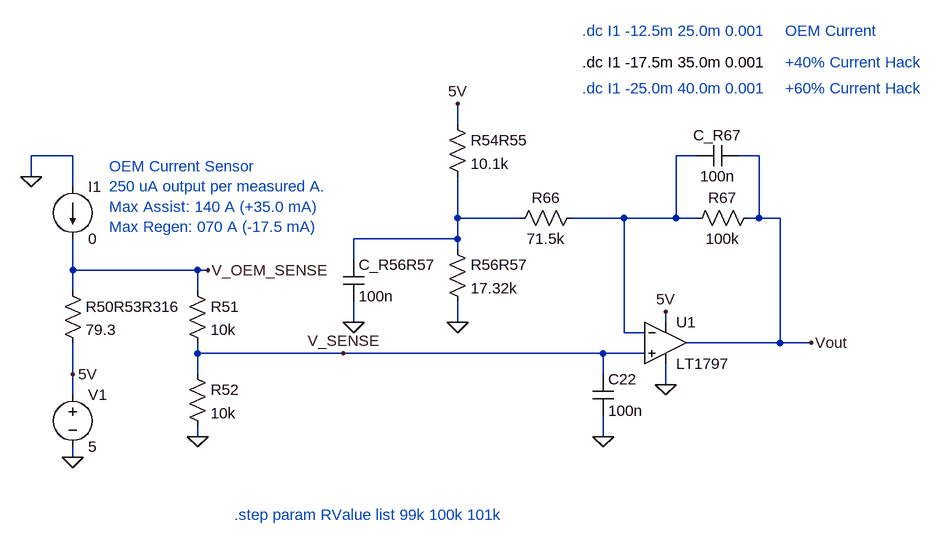
[diagram p0: schematic OEM Current Sensor Reconfigured Unipolar - Gain and Offset.asc]
OEM Current Sensor Reconfigured Unipolar - Gain and Offset.asc, the LTspice schematic file:
Version 4
SHEET 1 1712 744
WIRE 864 128 864 96
WIRE 272 176 208 176
WIRE 1232 176 1200 176
WIRE 1328 176 1296 176
WIRE 208 208 208 176
WIRE 272 224 272 176
WIRE 864 272 864 208
WIRE 960 272 864 272
WIRE 1120 272 1040 272
WIRE 1200 272 1200 176
WIRE 1200 272 1120 272
WIRE 1232 272 1200 272
WIRE 1328 272 1328 176
WIRE 1328 272 1312 272
WIRE 1360 272 1328 272
WIRE 864 304 864 272
WIRE 864 304 704 304
WIRE 864 320 864 304
WIRE 704 336 704 304
WIRE 272 352 272 304
WIRE 464 352 272 352
WIRE 480 352 464 352
WIRE 272 384 272 352
WIRE 464 384 464 352
WIRE 704 432 704 400
WIRE 864 432 864 400
WIRE 1184 432 1184 416
WIRE 1120 448 1120 272
WIRE 1152 448 1120 448
WIRE 1360 464 1360 272
WIRE 1360 464 1216 464
WIRE 1408 464 1360 464
WIRE 464 480 464 464
WIRE 688 480 464 480
WIRE 1088 480 688 480
WIRE 1152 480 1088 480
WIRE 272 512 272 464
WIRE 464 512 464 480
WIRE 1088 512 1088 480
WIRE 1184 528 1184 496
WIRE 272 544 272 512
WIRE 464 608 464 592
WIRE 1088 608 1088 576
WIRE 272 640 272 624
FLAG 272 640 0
FLAG 208 208 0
FLAG 464 608 0
FLAG 688 480 V_SENSE
FLAG 480 352 V_OEM_SENSE
FLAG 864 432 0
FLAG 1184 528 0
FLAG 1184 416 5V
FLAG 864 96 5V
FLAG 1408 464 Vout
FLAG 272 512 5V
FLAG 704 432 0
FLAG 1088 608 0
SYMBOL current 272 224 R0
SYMATTR InstName I1
SYMATTR Value 0
SYMBOL voltage 272 528 R0
SYMATTR InstName V1
SYMATTR Value 5
SYMBOL res 256 368 R0
SYMATTR InstName R50R53R316
SYMATTR Value 79.3
SYMBOL res 448 368 R0
SYMATTR InstName R51
SYMATTR Value 10k
SYMBOL res 448 496 R0
SYMATTR InstName R52
SYMATTR Value 10k
SYMBOL OpAmps/LT1797 1184 400 R0
SYMATTR InstName U1
SYMBOL res 848 112 R0
SYMATTR InstName R54R55
SYMATTR Value 10.1k
SYMBOL res 848 304 R0
SYMATTR InstName R56R57
SYMATTR Value 17.32k
SYMBOL res 944 288 R270
WINDOW 0 32 56 VTop 2
WINDOW 3 0 56 VBottom 2
SYMATTR InstName R66
SYMATTR Value 71.5k
SYMBOL res 1216 288 R270
WINDOW 0 32 56 VTop 2
WINDOW 3 0 56 VBottom 2
SYMATTR InstName R67
SYMATTR Value 100k
SYMBOL cap 1296 160 R90
WINDOW 0 0 32 VBottom 2
WINDOW 3 32 32 VTop 2
SYMATTR InstName C_R67
SYMATTR Value 100n
SYMBOL cap 688 336 R0
SYMATTR InstName C_R56R57
SYMATTR Value 100n
SYMBOL cap 1072 512 R0
SYMATTR InstName C22
SYMATTR Value 100n
TEXT 328 192 Left 2 ;OEM Current Sensor\n250 uA output per measured A.\nMax Assist: 140 A (+35.0 mA)\nMax Regen: 070 A (-17.5 mA)
TEXT 1056 32 Left 2 !.dc I1 -17.5m 35.0m 0.001
TEXT 1368 32 Left 2 ;+40% Current Hack
TEXT 1056 -16 Left 2 ;.dc I1 -12.5m 25.0m 0.001
TEXT 1368 -16 Left 2 ;OEM Current
TEXT 520 728 Left 2 ;.step param RValue list 99k 100k 101k
TEXT 1368 72 Left 2 ;+60% Current Hack
TEXT 1056 72 Left 2 ;.dc I1 -25.0m 40.0m 0.001

The netlist it stands for:
* OEM Current Sensor Reconfigured Unipolar - Gain and Offset.asc
I1 0 V_OEM_SENSE 0
V1 5V 0 5
R50R53R316 V_OEM_SENSE 5V 79.3
R51 V_OEM_SENSE V_SENSE 10k
R52 V_SENSE 0 10k
XU1 V_SENSE N001 5V 0 Vout LT1797  ; pins In+ In- V+ V- OUT
R54R55 5V N002 10.1k
R56R57 N002 0 17.32k
R66 N002 N001 71.5k
R67 N001 Vout 100k
C_R67 Vout N001 100n
C_R56R57 N002 0 100n
C22 V_SENSE 0 100n
* OEM Current Sensor
* 250 uA output per measured A.
* Max Assist: 140 A (+35.0 mA)
* Max Regen: 070 A (-17.5 mA)
.dc I1 -17.5m 35.0m 0.001
* +40% Current Hack
* .dc I1 -12.5m 25.0m 0.001
* OEM Current
* .step param RValue list 99k 100k 101k
* +60% Current Hack
* .dc I1 -25.0m 40.0m 0.001
.backanno
.end